# EAGLE schematic backplane (EAGLE 5.11)
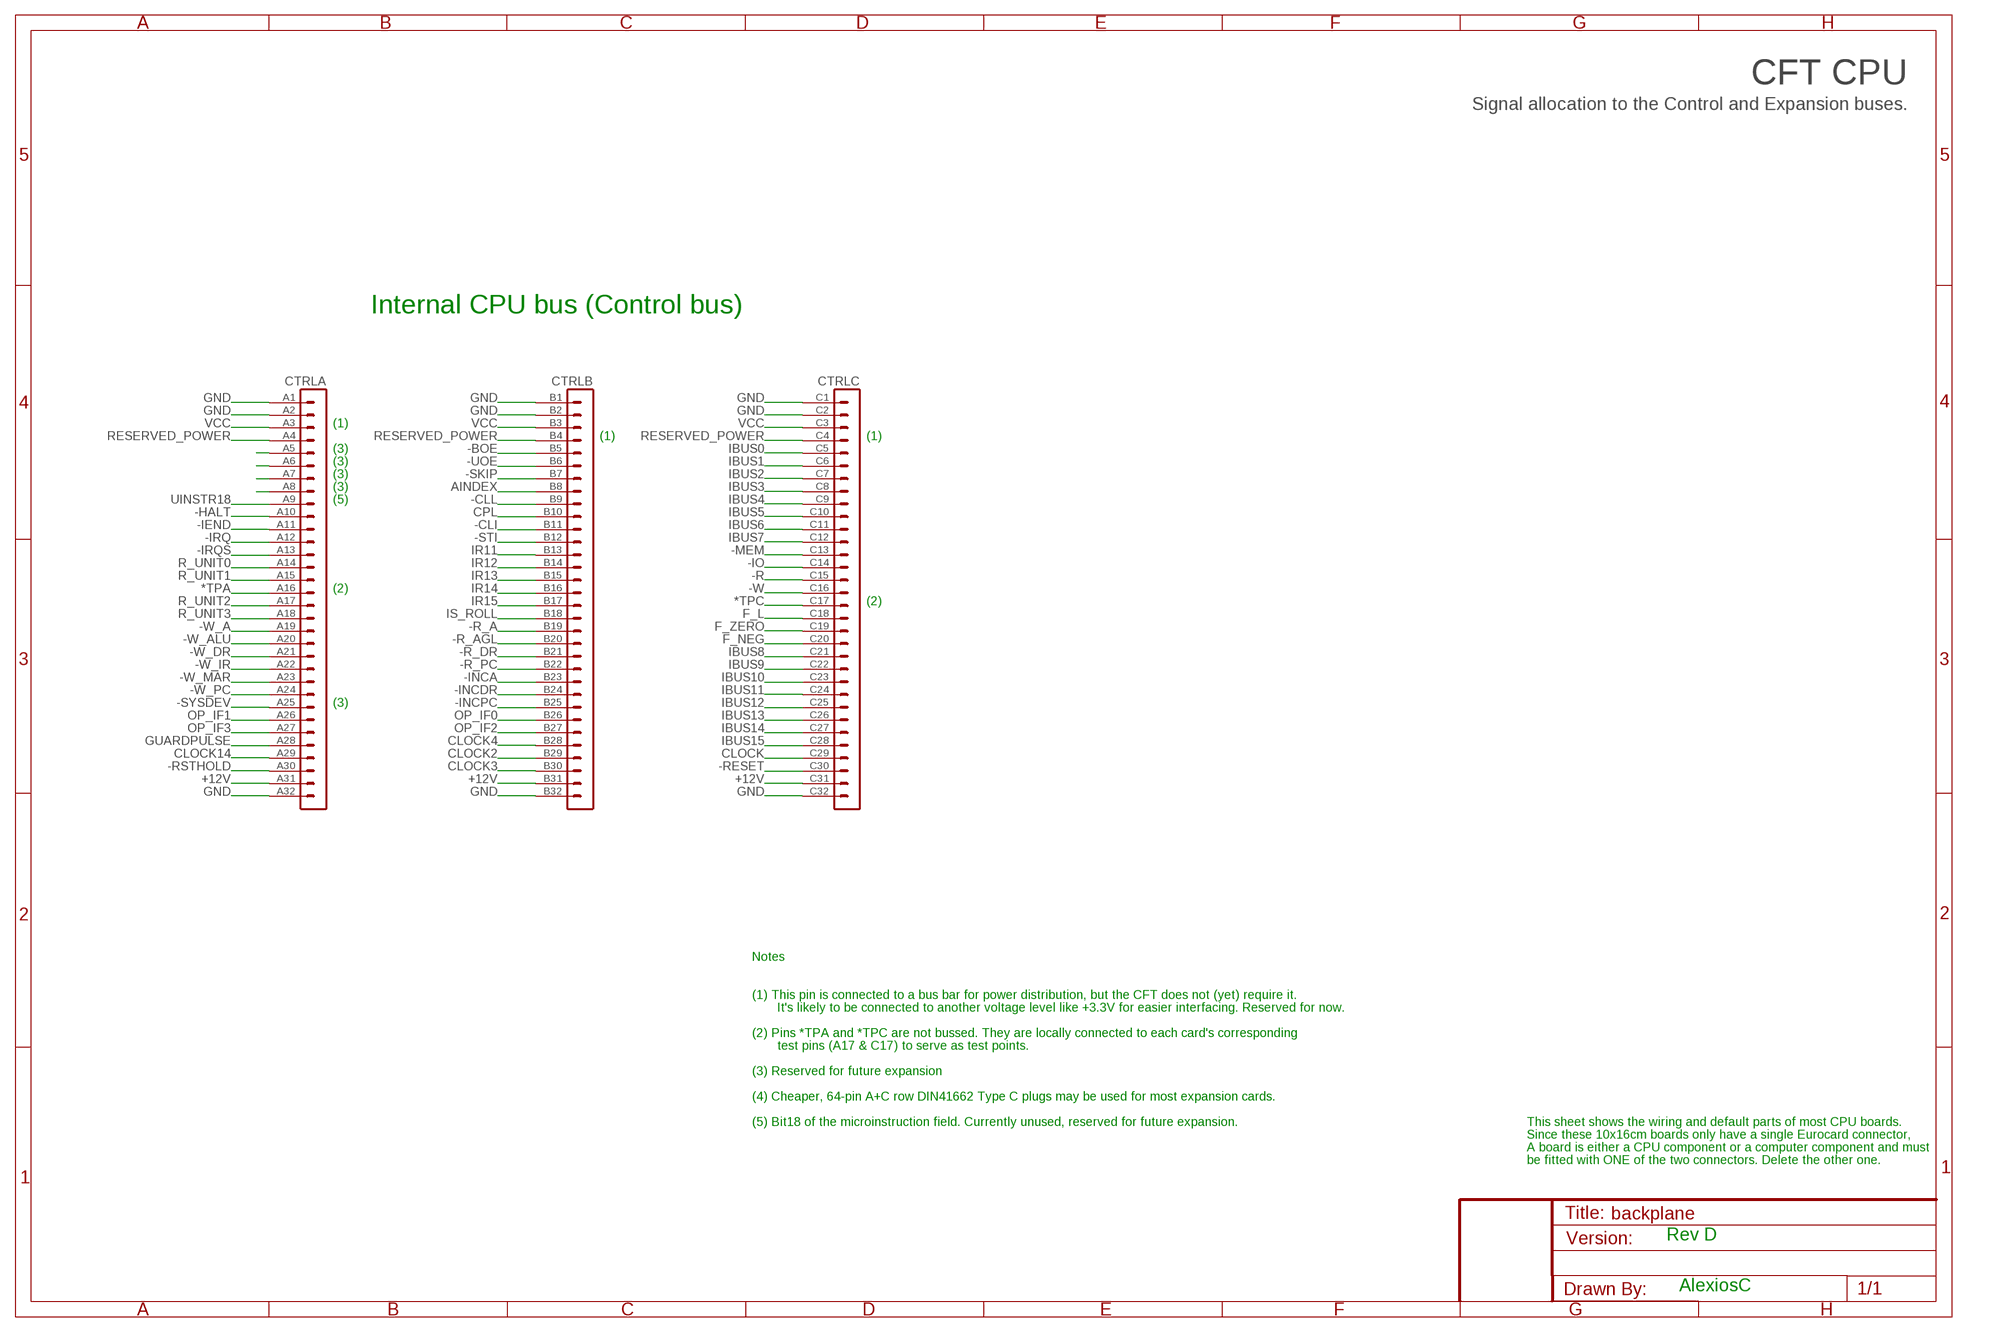
[diagram p0: schematic, sheet 1]

## Parts
CTRL  VG96-3B  [VG96B]

## Nets
*TPA: CTRL.A16
*TPC: CTRL.C17
+12V [12V]: CTRL.A31 CTRL.B31 CTRL.C31
-BOE: CTRL.B5
-CLI: CTRL.B11
-CLL: CTRL.B9
-HALT: CTRL.A10
-IEND: CTRL.A11
-INCA: CTRL.B23
-INCDR: CTRL.B24
-INCPC: CTRL.B25
-IO: CTRL.C14
-IRQ: CTRL.A12
-IRQS: CTRL.A13
-MEM: CTRL.C13
-R: CTRL.C15
-R_A: CTRL.B19
-R_AGL: CTRL.B20
-R_DR: CTRL.B21
-R_PC: CTRL.B22
-RESET: CTRL.C30
-RSTHOLD: CTRL.A30
-SKIP: CTRL.B7
-STI: CTRL.B12
-SYSDEV: CTRL.A25
-UOE: CTRL.B6
-W: CTRL.C16
-W_A: CTRL.A19
-W_ALU: CTRL.A20
-W_DR: CTRL.A21
-W_IR: CTRL.A22
-W_MAR: CTRL.A23
-W_PC: CTRL.A24
AINDEX: CTRL.B8
CLOCK: CTRL.C29
CLOCK2: CTRL.B29
CLOCK3: CTRL.B30
CLOCK4: CTRL.B28
CLOCK14: CTRL.A29
CPL: CTRL.B10
F_L: CTRL.C18
F_NEG: CTRL.C20
F_ZERO: CTRL.C19
GND: CTRL.A1 CTRL.A2 CTRL.A32 CTRL.B1 CTRL.B2 CTRL.B32 CTRL.C1 CTRL.C2 CTRL.C32
GUARDPULSE: CTRL.A28
IBUS0: CTRL.C5
IBUS1: CTRL.C6
IBUS2: CTRL.C7
IBUS3: CTRL.C8
IBUS4: CTRL.C9
IBUS5: CTRL.C10
IBUS6: CTRL.C11
IBUS7: CTRL.C12
IBUS8: CTRL.C21
IBUS9: CTRL.C22
IBUS10: CTRL.C23
IBUS11: CTRL.C24
IBUS12: CTRL.C25
IBUS13: CTRL.C26
IBUS14: CTRL.C27
IBUS15: CTRL.C28
IR11: CTRL.B13
IR12: CTRL.B14
IR13: CTRL.B15
IR14: CTRL.B16
IR15: CTRL.B17
IS_ROLL: CTRL.B18
N$7: CTRL.A5
N$49: CTRL.A8
N$50: CTRL.A7
N$51: CTRL.A6
OP_IF0: CTRL.B26
OP_IF1: CTRL.A26
OP_IF2: CTRL.B27
OP_IF3: CTRL.A27
R_UNIT0: CTRL.A14
R_UNIT1: CTRL.A15
R_UNIT2: CTRL.A17
R_UNIT3: CTRL.A18
RESERVED_POWER: CTRL.A4 CTRL.B4 CTRL.C4
UINSTR18: CTRL.A9
VCC: CTRL.A3 CTRL.B3 CTRL.C3

## Notes on the sheet
- CFT CPU
- Signal allocation to the Control and Expansion buses.
- Internal CPU bus (Control bus)
- (1)
- (1) | (1)
- (3)
- (3)
- (3)
- (3)
- (5)
- (2)
- (2)
- (3)
- Notes
- (1) This pin is connected to a bus bar for power distribution, but the CFT does not (yet) require it.
- It's likely to be connected to another voltage level like +3.3V for easier interfacing. Reserved for now.
- (2) Pins *TPA and *TPC are not bussed. They are locally connected to each card's corresponding
- test pins (A17 & C17) to serve as test points.
- (3) Reserved for future expansion
- (4) Cheaper, 64-pin A+C row DIN41662 Type C plugs may be used for most expansion cards.
- (5) Bit18 of the microinstruction field. Currently unused, reserved for future expansion. | This sheet shows the wiring and default parts of most CPU boards.
- Since these 10x16cm boards only have a single Eurocard connector,
- A board is either a CPU component or a computer component and must
- be fitted with ONE of the two connectors. Delete the other one.
- Rev D
- AlexiosC

## Library data of the parts
CTRL = 19inch:VG96-3: PCB EUROCARD, 96-pin type C/ABC, 2.54 mm

## Net classes
0 default: width 0.406 mm, clearance 0.305 mm
2 12V: width 1.016 mm, clearance 1.016 mm